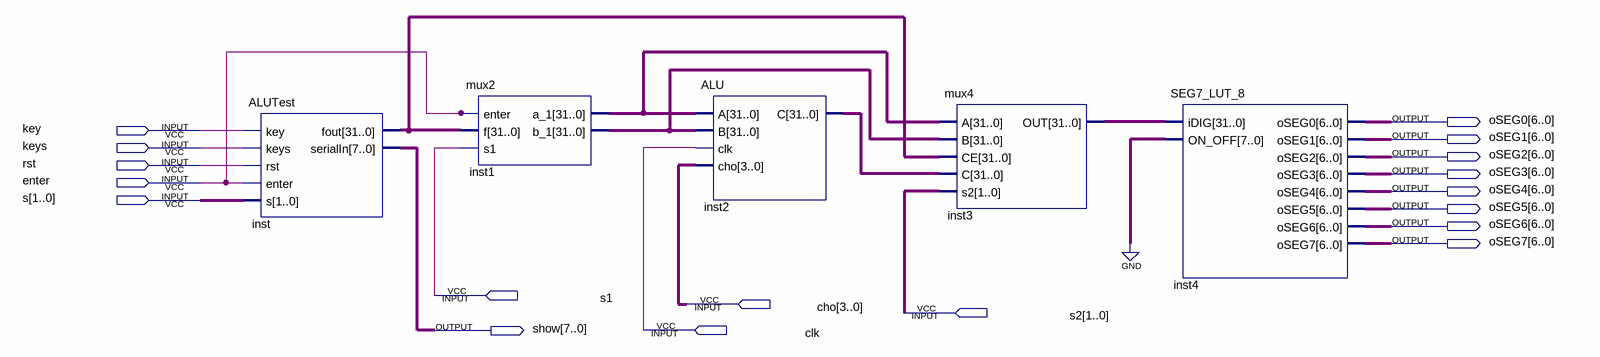
[diagram p0: schematic sheet]
// Quartus schematic ALUTest.bdf as structural Verilog: 5 symbols, 18 pins
module ALUTest (
  input  key,
  input  keys,
  input  rst,
  input  enter,
  input  [1:0] s,
  input  s1,
  input  [3:0] cho,
  input  [1:0] s2,
  input  clk,
  output [6:0] oSEG0,
  output [6:0] oSEG1,
  output [6:0] oSEG2,
  output [6:0] oSEG3,
  output [6:0] oSEG4,
  output [6:0] oSEG5,
  output [6:0] oSEG6,
  output [6:0] oSEG7,
  output [7:0] show
);

  wire [31:0] inst1_a_1, inst1_b_1, inst2_c, inst3_out, inst_fout;

  ALUTest inst (.key(key), .keys(keys), .rst(rst), .enter(enter), .s(s), .fout(inst_fout), .serialIn(show));
  mux2 inst1 (.enter(enter), .f(inst_fout), .s1(s1), .a_1(inst1_a_1), .b_1(inst1_b_1));
  ALU inst2 (.A(inst1_a_1), .B(inst1_b_1), .clk(clk), .cho(cho), .C(inst2_c));
  mux4 inst3 (.A(inst1_a_1), .B(inst1_b_1), .CE(inst_fout), .C(inst2_c), .s2(s2), .OUT(inst3_out));
  SEG7_LUT_8 inst4 (
    .iDIG(inst3_out), .ON_OFF({8{1'b0}}), .oSEG0(oSEG0), .oSEG1(oSEG1), .oSEG2(oSEG2), .oSEG3(oSEG3),
    .oSEG4(oSEG4), .oSEG5(oSEG5), .oSEG6(oSEG6), .oSEG7(oSEG7));
endmodule
